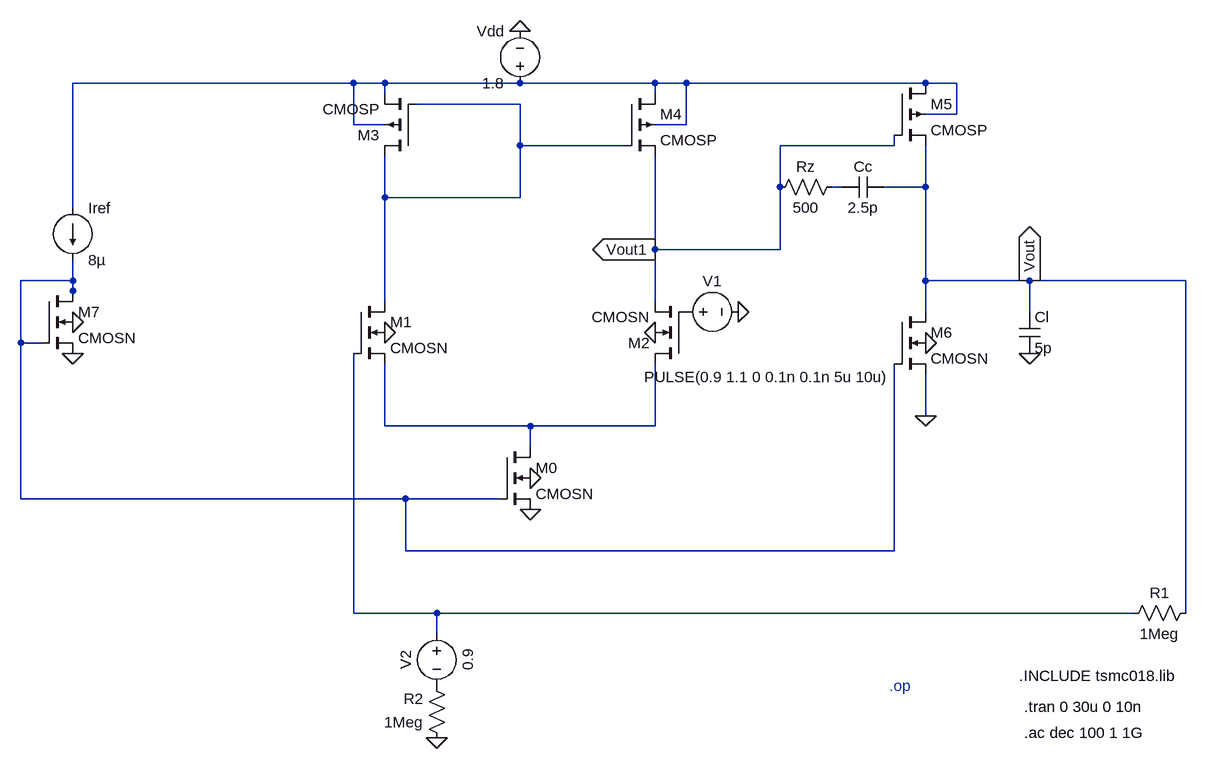
[diagram p0: schematic 2-Stage-OTA_ClosedLoop.asc]
2-Stage-OTA_ClosedLoop.asc, the LTspice schematic file:
Version 4.1
SHEET 1 2208 856
WIRE 352 -256 -80 -256
WIRE 400 -256 352 -256
WIRE 608 -256 400 -256
WIRE 816 -256 608 -256
WIRE 864 -256 816 -256
WIRE 1232 -256 864 -256
WIRE 1280 -256 1232 -256
WIRE 400 -240 400 -256
WIRE 816 -240 816 -256
WIRE 608 -224 448 -224
WIRE 1280 -208 1280 -256
WIRE 1280 -208 1232 -208
WIRE 352 -192 352 -256
WIRE 400 -192 352 -192
WIRE 864 -192 864 -256
WIRE 864 -192 816 -192
WIRE 608 -160 608 -224
WIRE 768 -160 608 -160
WIRE 1184 -160 1184 -176
WIRE 1184 -160 1008 -160
WIRE 1008 -96 1008 -160
WIRE 1104 -96 1088 -96
WIRE 1232 -96 1232 -160
WIRE 1232 -96 1168 -96
WIRE 400 -80 400 -144
WIRE 608 -80 608 -160
WIRE 608 -80 400 -80
WIRE -80 -64 -80 -256
WIRE 816 0 816 -144
WIRE 1008 0 1008 -96
WIRE 1008 0 816 0
WIRE -80 48 -80 16
WIRE -80 48 -160 48
WIRE 1232 48 1232 -96
WIRE 1392 48 1232 48
WIRE 1632 48 1392 48
WIRE -80 64 -80 48
WIRE -80 80 -80 64
WIRE 400 80 400 -80
WIRE 816 80 816 0
WIRE 1232 96 1232 48
WIRE 1392 96 1392 48
WIRE -160 144 -160 48
WIRE -128 144 -160 144
WIRE 1232 256 1232 192
WIRE 400 272 400 176
WIRE 624 272 400 272
WIRE 816 272 816 176
WIRE 816 272 624 272
WIRE 624 304 624 272
WIRE -160 384 -160 144
WIRE 432 384 -160 384
WIRE 576 384 432 384
WIRE 432 464 432 384
WIRE 1184 464 1184 176
WIRE 1184 464 432 464
WIRE 352 560 352 160
WIRE 480 560 352 560
WIRE 1552 560 480 560
WIRE 1632 560 1632 48
WIRE 480 592 480 560
FLAG 624 400 0
FLAG 624 352 0
FLAG 400 128 0
FLAG 816 128 0
FLAG 608 -336 0
FLAG -80 112 0
FLAG 1232 256 0
FLAG 1392 160 0
FLAG 1392 48 Vout
IOPIN 1392 48 Out
FLAG 816 0 Vout1
IOPIN 816 0 Out
FLAG 1232 144 0
FLAG 944 96 0
FLAG -80 160 0
FLAG 480 752 0
SYMBOL cmosn 1184 96 R0
SYMATTR InstName M6
SYMATTR Value2 l=0.5u w=21.75u
SYMBOL cmosn 576 304 R0
SYMATTR InstName M0
SYMATTR Value2 l=0.5u w=8.7u
SYMBOL cmosn 864 176 R180
SYMATTR InstName M2
SYMATTR Value2 l=0.5u w=4.35u
SYMBOL cmosn 352 80 R0
SYMATTR InstName M1
SYMATTR Value2 l=0.5u w=4.35u
SYMBOL cmosn -128 64 R0
SYMATTR InstName M7
SYMATTR Value2 l=0.5u w=0.869u
SYMBOL cmosp 768 -240 R0
SYMATTR InstName M4
SYMATTR Value2 l=0.5u w=10u
SYMBOL cmosp 1184 -256 R0
SYMATTR InstName M5
SYMATTR Value2 l=0.5u w=50u
SYMBOL cmosp 448 -144 R180
SYMATTR InstName M3
SYMATTR Value2 l=0.5u w=10u
SYMBOL voltage 608 -240 R180
WINDOW 0 24 96 Left 2
WINDOW 3 24 16 Left 2
SYMATTR InstName Vdd
SYMATTR Value 1.8
SYMBOL current -80 -64 R0
WINDOW 123 0 0 Left 0
WINDOW 39 0 0 Left 0
SYMATTR InstName Iref
SYMATTR Value 8µ
SYMBOL cap 1376 96 R0
SYMATTR InstName Cl
SYMATTR Value 5p
SYMBOL cap 1168 -112 R90
WINDOW 3 32 32 VTop 2
WINDOW 0 0 32 VBottom 2
SYMATTR Value 2.5p
SYMATTR InstName Cc
SYMBOL res 1104 -112 R90
WINDOW 0 0 56 VBottom 2
WINDOW 3 32 56 VTop 2
SYMATTR InstName Rz
SYMATTR Value 500
SYMBOL voltage 848 96 R270
WINDOW 0 32 56 VTop 2
WINDOW 3 -85 140 VBottom 2
WINDOW 123 -113 140 VBottom 2
WINDOW 39 0 0 Left 0
SYMATTR InstName V1
SYMATTR Value PULSE(0.9 1.1 0 0.1n 0.1n 5u 10u)
SYMBOL voltage 480 576 R0
WINDOW 0 -32 56 VBottom 2
WINDOW 3 32 56 VTop 2
WINDOW 123 60 56 VTop 2
WINDOW 39 0 0 Left 0
SYMATTR InstName V2
SYMATTR Value 0.9
SYMBOL res 1648 544 R90
WINDOW 0 0 56 VBottom 2
WINDOW 3 32 56 VTop 2
SYMATTR InstName R1
SYMATTR Value 1Meg
SYMBOL res 496 768 R180
WINDOW 0 36 76 Left 2
WINDOW 3 36 40 Left 2
SYMATTR InstName R2
SYMATTR Value 1Meg
TEXT 1376 656 Left 2 !.INCLUDE tsmc018.lib
TEXT 1384 744 Left 2 !.ac dec 100 1 1G
TEXT 1176 672 Left 2 ;.op
TEXT 1384 704 Left 2 !.tran 0 30u 0 10n

The netlist it stands for:
* 2-Stage-OTA_ClosedLoop.asc
M6 Vout N004 0 0 CMOSN l=0.5u w=21.75u
M0 N005 N004 0 0 CMOSN l=0.5u w=8.7u
M2 N005 P001 Vout1 0 CMOSN l=0.5u w=4.35u
M1 N002 N006 N005 0 CMOSN l=0.5u w=4.35u
M7 N004 N004 0 0 CMOSN l=0.5u w=0.869u
M4 N001 N002 Vout1 N001 CMOSP l=0.5u w=10u
M5 N001 Vout1 Vout N001 CMOSP l=0.5u w=50u
M3 N002 N002 N001 N001 CMOSP l=0.5u w=10u
Vdd N001 0 1.8
Iref N001 N004 8µ
Cl Vout 0 5p
Cc Vout N003 2.5p
Rz N003 Vout1 500
V1 P001 0 PULSE(0.9 1.1 0 0.1n 0.1n 5u 10u)
V2 N006 P002 0.9
R1 Vout N006 1Meg
R2 0 P002 1Meg
.model NMOS NMOS
.model PMOS PMOS
.lib standard.mos
.INCLUDE tsmc018.lib
.ac dec 100 1 1G
* .op
.tran 0 30u 0 10n
.backanno
.end